# EAGLE design Board (EAGLE 9.6.2)
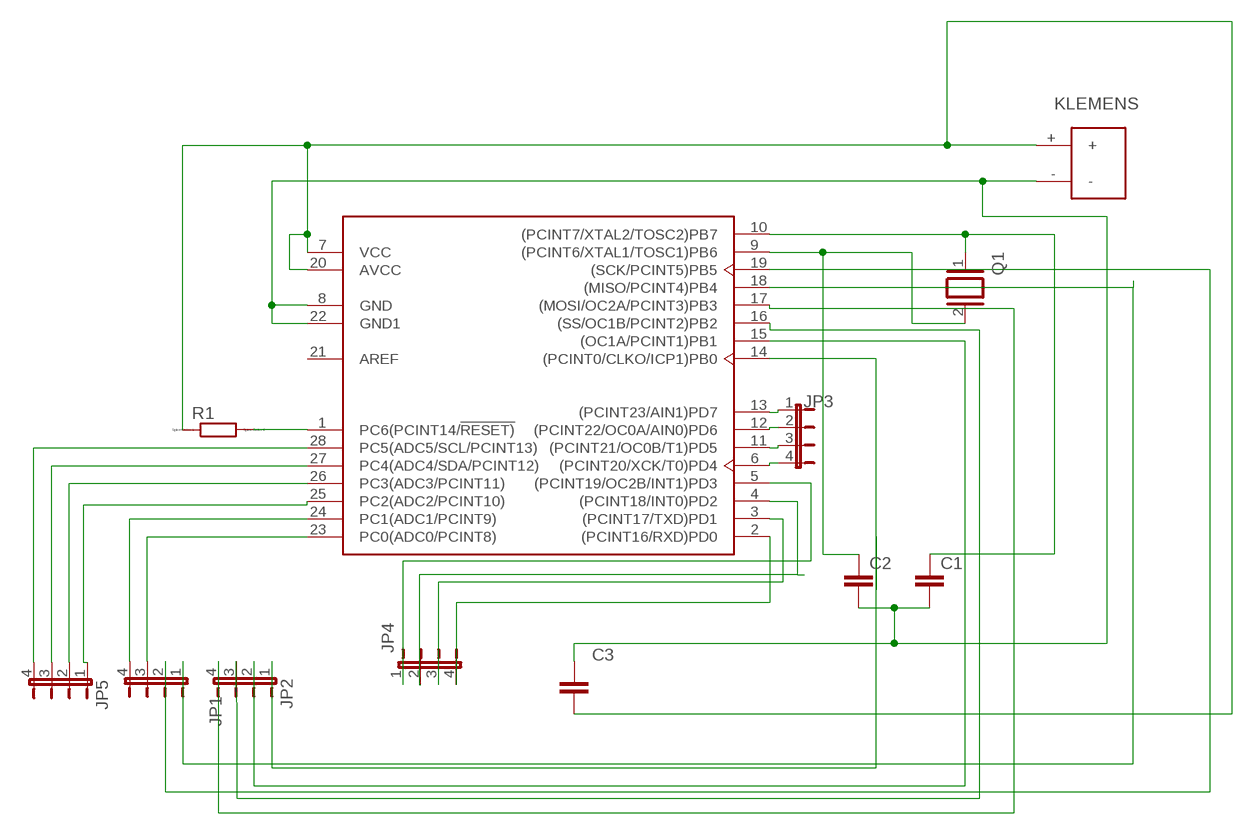
[diagram p0: schematic, sheet 1]

## Parts
C1  C-EU050-025X075  [C050-025X075]
C2  C-EU050-025X075  [C050-025X075]
C3  C_RADIAL-12.5MM-DIA  [CAPRD550W60D1025H1250B]
JP1  JP4E  [JP4]
JP2  JP4E  [JP4]
JP3  JP4E  [JP4]
JP4  JP4E  [JP4]
JP5  JP4E  [JP4]
Q1  XTAL/S  [QS]
R1  R0207/10  [0207/10]
U1  ATMEGA328P-PU  [DIP-28]
U$1  2X1KLEMENS  [2X1KLEMENS]

## Nets
N$1: C3.2 R1.1 U1.7(VCC) U1.20(AVCC) U$1.+
N$2: JP4.4 U1.2((PCINT16/RXD)PD0)
N$3: R1.2 U1.1(PC6(PCINT14/!RESET))
N$4: C1.1 Q1.1 U1.10((PCINT7/XTAL2/TOSC2)PB7)
N$5: C2.1 Q1.2 U1.9((PCINT6/XTAL1/TOSC1)PB6)
N$6: C1.2 C2.2 C3.1 U1.8(GND) U1.22(GND1) U$1.-
N$8: JP4.2 U1.4((PCINT18/INT0)PD2)
N$9: JP4.3 U1.3((PCINT17/TXD)PD1)
N$11: JP3.1 U1.13((PCINT23/AIN1)PD7)
N$12: JP3.2 U1.12((PCINT22/OC0A/AIN0)PD6)
N$13: JP3.3 U1.11((PCINT21/OC0B/T1)PD5)
N$14: JP2.1 U1.14((PCINT0/CLKO/ICP1)PB0)
N$15: JP2.2 U1.15((OC1A/PCINT1)PB1)
N$16: JP2.3 U1.16((SS/OC1B/PCINT2)PB2)
N$17: JP2.4 U1.17((MOSI/OC2A/PCINT3)PB3)
N$18: JP1.1 U1.18((MISO/PCINT4)PB4)
N$19: JP1.2 U1.19((SCK/PCINT5)PB5)
N$20: JP1.3 U1.23(PC0(ADC0/PCINT8))
N$21: JP1.4 U1.24(PC1(ADC1/PCINT9))
N$22: JP5.2 U1.26(PC3(ADC3/PCINT11))
N$23: JP5.3 U1.27(PC4(ADC4/SDA/PCINT12))
N$24: JP5.4 U1.28(PC5(ADC5/SCL/PCINT13))
N$25: JP4.1 U1.5((PCINT19/OC2B/INT1)PD3)
N$26: JP5.1 U1.25(PC2(ADC2/PCINT10))
N$27: JP3.4 U1.6((PCINT20/XCK/T0)PD4)
Unconnected: U1.21(AREF)

## Library data of the parts
C1 C2 = libraryAtmega:C-EU: CAPACITOR, European symbol; SPICEPREFIX: C
C3 = Capacitor:C: Capacitor - Generic; CATEGORY: Capacitor
JP1-JP5 = libraryAtmega:JP4E: JUMPER
Q1 = libraryAtmega:XTAL/S: CRYSTAL
R1 = libraryAtmega:R: RESISTOR, European symbol; SPICEMODEL: NONE; SPICEPREFIX: R
U1 = libraryAtmega:ATMEGA328P-PU: IC MCU 8BIT 32KB FLASH 28DIP Manufacturer's datasheet <http://ww1.microchip.com/downloads/en/DeviceDoc/ATmega48A-PA-88A-PA-168A-PA-328-P-DS-DS40002061A.pdf>; CREATED_BY: PCBLayout.com; DIGIKEY_PART_NUMBER: ATMEGA328P-PU-ND; MANUFACTURER: Microchip Technology; MPN: ATMEGA328P-PU; PACKAGE: DIP-28
U$1 = libraryAtmega:2X1KLEMENS

## Board
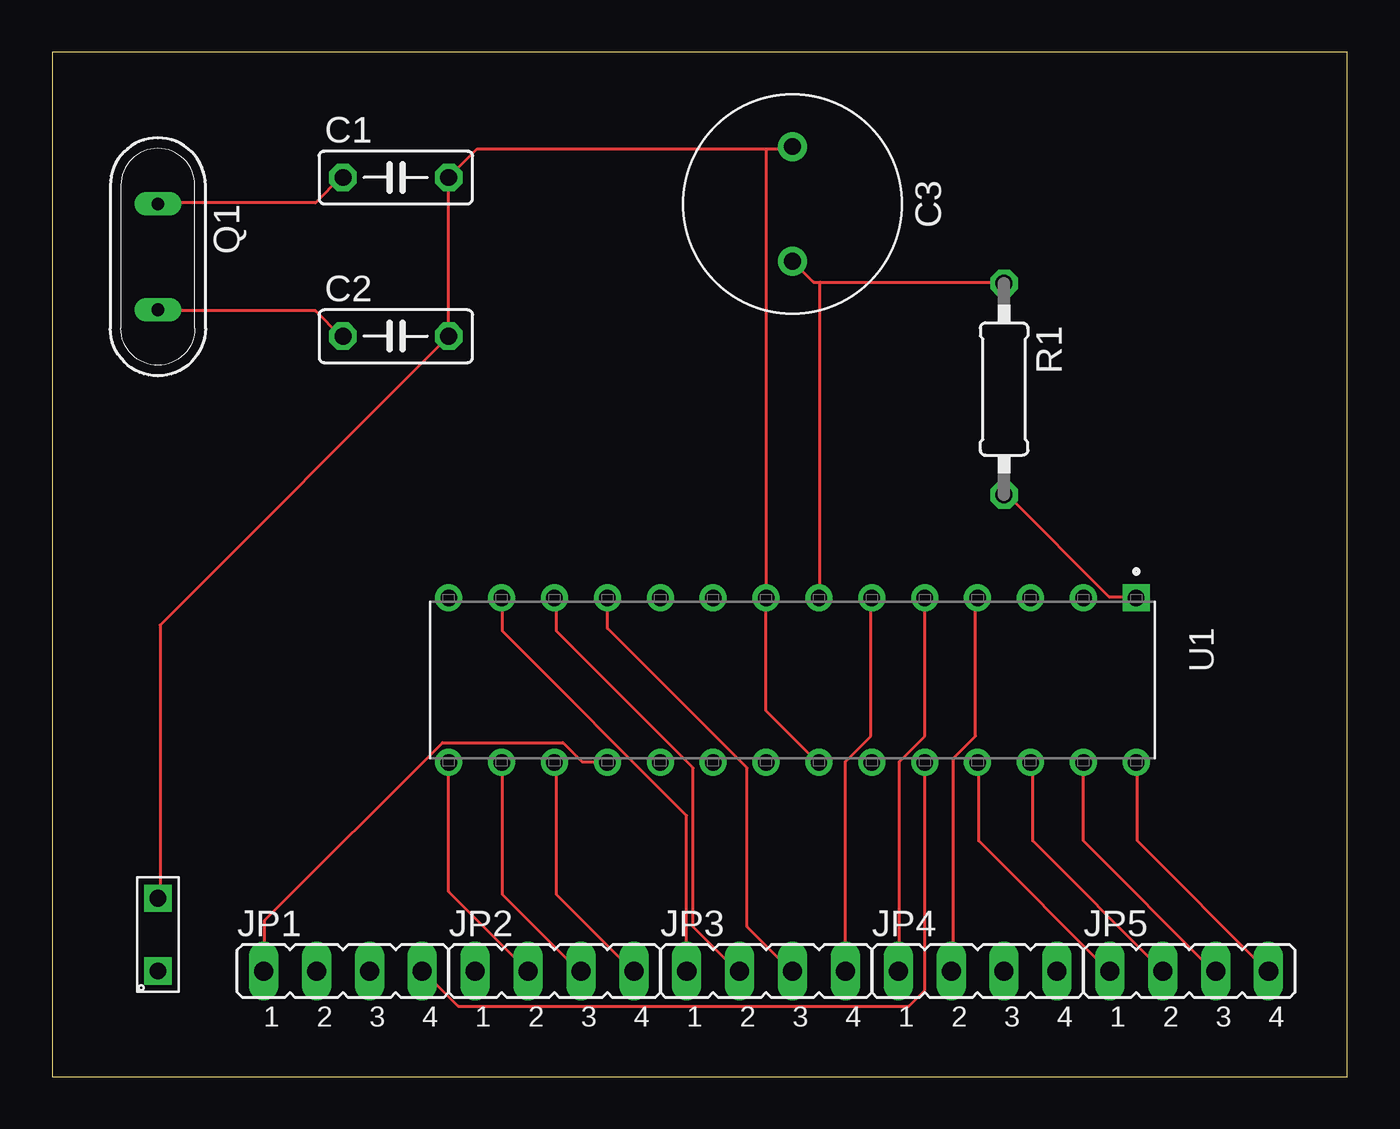
[diagram p1: board, top side]
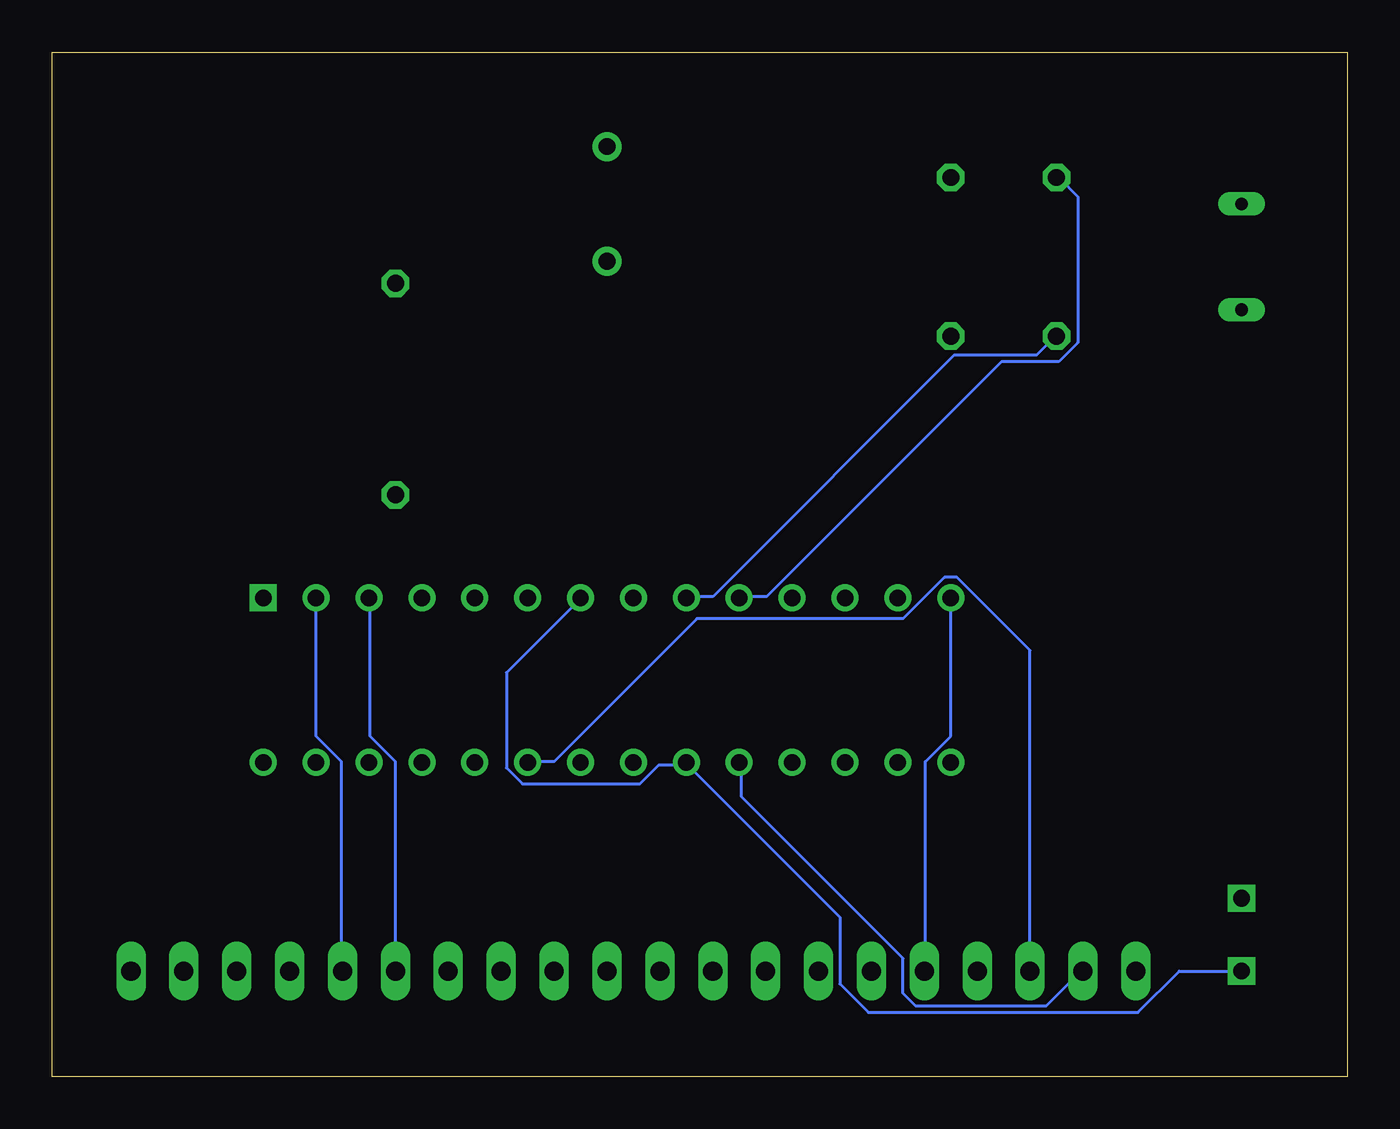
[diagram p2: board, bottom side, seen from below]

Size 62.21 x 49.2 mm. Coordinates in mm from the lower left corner, seen from the top.
Outline: 0,0 62.21,0 62.21,49.2 0,49.2 0,0
Copper layers (1*16): Top 0.035mm / dielectric 1.5mm / Bottom 0.035mm
Design rules "default": minimum track width 6mil, minimum drill 0.35mm, track to track 6mil, track to pad 6mil, pad to pad 6mil, via to via 6mil, smd to smd 6mil, copper to edge 40mil, drill to drill 6mil, minimum pad ring 10mil, minimum via ring 8mil, stop-mask expansion 4mil, vias tented up to drill 0mil, thermal gap 10mil

### Footprints (pad centres in the part's own frame; a part is rotated, then mirrored left to right if it is on the bottom)
C050-025X075 = drill 0.813 octagon: 1 -2.54,0; 2 2.54,0
CAPRD550W60D1025H1250B = drill 0.8 pad 1.4: 1 -2.75,0; 2 2.75,0
JP4 = drill 0.914 long: 1 -3.81,0; 2 -1.27,0; 3 1.27,0; 4 3.81,0
QS = drill 0.61 long: 1 -2.54,0; 2 2.54,0
0207/10 = drill 0.813 octagon: 1 -5.08,0; 2 5.08,0
DIP-28 = drill 0.79 pad 1.19 square: 1 -3.95,16.51 | drill 0.79 pad 1.19: 2 -3.95,13.97; 3 -3.95,11.43; 4 -3.95,8.89; 5 -3.95,6.35; 6 -3.95,3.81; 7 -3.95,1.27; 8 -3.95,-1.27; 9 -3.95,-3.81; 10 -3.95,-6.35; 11 -3.95,-8.89; 12 -3.95,-11.43; 13 -3.95,-13.97; 14 -3.95,-16.51; 15 3.95,-16.51; 16 3.95,-13.97; 17 3.95,-11.43; 18 3.95,-8.89; 19 3.95,-6.35; 20 3.95,-3.81; 21 3.95,-1.27; 22 3.95,1.27; 23 3.95,3.81; 24 3.95,6.35; 25 3.95,8.89; 26 3.95,11.43; 27 3.95,13.97; 28 3.95,16.51
2X1KLEMENS = drill 0.8 pad 1.27 square: + 0,0; - 3.5,0

### Placement (x,y rotation side)
C1  16.51,43.18 0 top
C2  16.51,35.56 0 top
C3  35.56,41.91 270 top
JP1  13.97,5.08 0 top
JP2  24.13,5.08 0 top
JP3  34.29,5.08 0 top
JP4  44.45,5.08 0 top
JP5  54.61,5.08 0 top
Q1  5.08,39.37 270 top
R1  45.72,33.02 270 top
U1  35.56,19.05 270 top
U$1  5.08,5.08 90 top

### Tracks (layer width: path | path; a pad name or v marks a point on that pad's centre or on a via)
N$1
  Top 0.152: 36.88,38.15 36.58,38.15 35.66,39.07 C3.2 | 36.88,38.15 45.72,38.15 R1.1 | 36.88,38.15 36.88,23.06 U1.7
  Bottom 0.152: U1.7 36.88,22.91 40.39,19.41 40.39,14.83 39.62,14.07 33.98,14.07 33.07,14.99 31.85,14.99 U1.20 31.7,14.99 24.38,7.67 24.38,4.47 23.01,3.1 10.06,3.1 8.08,5.08 U$1.+
N$2
  Bottom 0.152: U1.2 49.53,16.36 48.31,15.14 48.31,5.08 JP4.4
N$3
  Top 0.152: R1.2 45.87,27.94 50.75,23.06 51.97,23.06 U1.1
N$4
  Top 0.152: Q1.1 5.18,41.96 12.65,41.96 13.87,43.18 C1.1
  Bottom 0.152: U1.10 29.11,23.06 27.89,23.06 16.61,34.34 13.87,34.34 12.95,35.26 12.95,42.27 13.87,43.18 C1.1
N$5
  Top 0.152: Q1.2 5.18,36.78 12.65,36.78 13.87,35.56 C2.1
  Bottom 0.152: U1.9 31.7,23.06 30.48,23.06 18.9,34.65 14.94,34.65 14.02,35.56 C2.1
N$6
  Top 0.152: U1.22 36.73,15.14 34.29,17.58 U1.8 34.29,44.55 | U$1.- 5.18,8.59 5.18,21.69 C2.2 C1.2 20.42,44.55 34.29,44.55 | 34.29,44.55 35.51,44.55 C3.1
N$8
  Top 0.152: U1.4 44.35,22.91 44.35,16.36 43.28,15.29 43.28,5.08 JP4.2
N$9
  Bottom 0.152: JP4.3 45.72,15.14 46.94,16.36 46.94,22.91 U1.3
N$11
  Top 0.152: JP3.1 30.48,12.55 21.64,21.39 21.64,22.91 U1.13
N$12
  Top 0.152: U1.12 24.23,22.91 24.23,21.39 30.79,14.83 30.79,7.21 32.92,5.08 JP3.2
N$13
  Top 0.152: U1.11 26.67,21.54 33.38,14.83 33.38,7.21 35.51,5.08 JP3.3
N$14
  Bottom 0.152: U1.14 19.05,16.36 20.27,15.14 20.27,5.08 JP2.1
N$15
  Top 0.152: U1.15 19.05,8.89 JP2.2
N$16
  Top 0.152: U1.16 21.64,14.99 21.64,8.74 25.3,5.08 JP2.3
N$17
  Top 0.152: U1.17 24.23,14.99 24.23,8.74 27.89,5.08 JP2.4
N$18
  Top 0.152: U1.18 26.67,15.14 25.45,15.14 24.54,16.05 18.75,16.05 10.21,7.52 10.21,5.08 JP1.1
N$19
  Bottom 0.152: U1.19 29.11,14.99 29.11,13.46 21.34,5.69 21.34,4.01 20.73,3.4 14.48,3.4 12.8,5.08 JP1.2
N$20
  Bottom 0.152: JP1.3 15.24,20.47 18.75,23.98 19.36,23.98 21.34,22 31.24,22 38.1,15.14 39.32,15.14 U1.23
N$21
  Top 0.152: U1.24 41.91,4.17 41.15,3.4 19.51,3.4 17.83,5.08 JP1.4
N$22
  Top 0.152: JP5.2 47.09,11.33 47.09,14.99 U1.26
N$23
  Top 0.152: U1.27 49.53,11.33 55.78,5.08 JP5.3
N$24
  Top 0.152: U1.28 52.12,14.99 52.12,11.33 58.37,5.08 JP5.4
N$25
  Top 0.152: U1.5 41.91,16.36 40.69,15.14 40.69,5.08 JP4.1
N$26
  Top 0.152: U1.25 44.5,14.99 44.5,11.33 50.75,5.08 JP5.1
N$27
  Top 0.152: JP3.4 38.1,15.14 39.32,16.36 39.32,22.91 U1.6